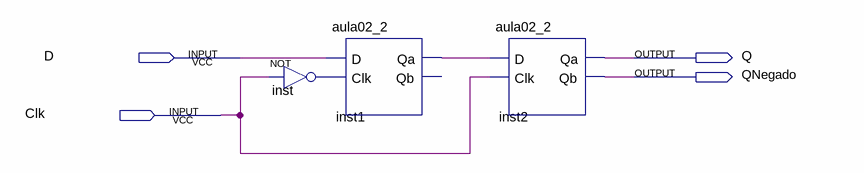
[diagram p0: schematic sheet]
// Quartus schematic aula02_3.bdf as structural Verilog: 3 symbols, 4 pins
module aula02_3 (
  input  D,
  input  Clk,
  output Q,
  output QNegado
);

  wire inst1_qa, inst_out;

  not inst (inst_out, Clk);
  aula02_2 inst1 (.D(D), .Clk(inst_out), .Qa(inst1_qa));  // open: Qb
  aula02_2 inst2 (.D(inst1_qa), .Clk(Clk), .Qa(Q), .Qb(QNegado));
endmodule
